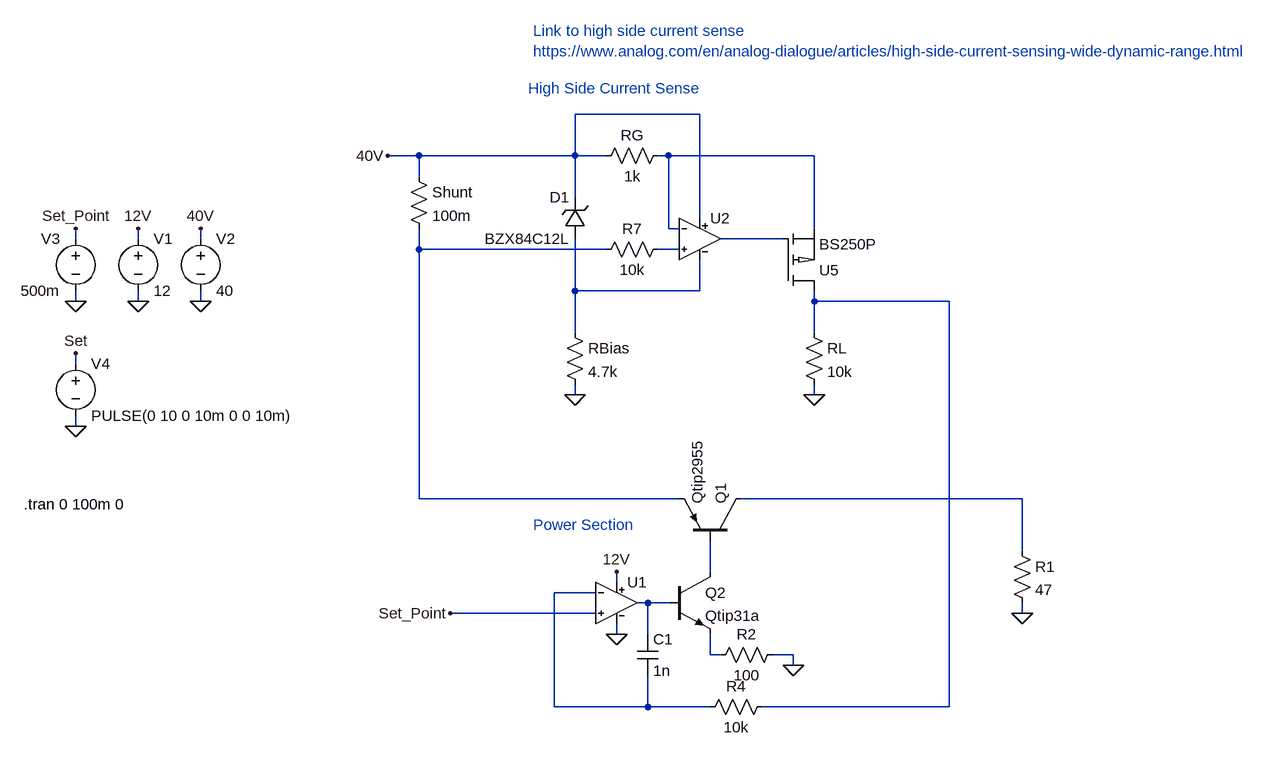
[diagram p0: schematic SolarEmulator.asc]
SolarEmulator.asc, the LTspice schematic file:
Version 4
SHEET 1 1780 980
WIRE 160 -64 -32 -64
WIRE -272 0 -320 0
WIRE -32 0 -32 -64
WIRE -32 0 -272 0
WIRE 16 0 -32 0
WIRE 112 0 96 0
WIRE 336 0 112 0
WIRE -272 32 -272 0
WIRE -32 64 -32 0
WIRE 160 96 160 -64
WIRE 112 112 112 0
WIRE 128 112 112 112
WIRE 336 112 336 0
WIRE -800 128 -800 112
WIRE -704 128 -704 112
WIRE -608 128 -608 112
WIRE 288 128 192 128
WIRE -272 144 -272 112
WIRE 16 144 -272 144
WIRE 128 144 96 144
WIRE -32 208 -32 128
WIRE 160 208 160 160
WIRE 160 208 -32 208
WIRE -800 224 -800 208
WIRE -704 224 -704 208
WIRE -608 224 -608 208
WIRE 336 224 336 208
WIRE 544 224 336 224
WIRE -32 272 -32 208
WIRE 336 272 336 224
WIRE -800 320 -800 304
WIRE -32 368 -32 352
WIRE 336 368 336 352
WIRE -800 416 -800 400
WIRE -272 528 -272 144
WIRE 128 528 -272 528
WIRE 656 528 224 528
WIRE 656 608 656 528
WIRE 176 640 176 592
WIRE 32 656 32 640
WIRE 0 672 -64 672
WIRE 80 688 64 688
WIRE 112 688 80 688
WIRE 0 704 -224 704
WIRE 656 704 656 688
WIRE 32 736 32 720
WIRE 80 736 80 688
WIRE 176 768 176 736
WIRE 192 768 176 768
WIRE 304 768 272 768
WIRE 304 784 304 768
WIRE -64 848 -64 672
WIRE 80 848 80 800
WIRE 80 848 -64 848
WIRE 176 848 80 848
WIRE 544 848 544 224
WIRE 544 848 256 848
FLAG -608 224 0
FLAG 336 368 0
FLAG -32 368 0
FLAG -608 112 40V
FLAG -320 0 40V
FLAG -704 224 0
FLAG -704 112 12V
FLAG 32 640 12V
FLAG 32 736 0
FLAG -800 224 0
FLAG -800 112 Set_Point
FLAG -224 704 Set_Point
FLAG -800 416 0
FLAG -800 304 Set
FLAG 304 784 0
FLAG 656 704 0
SYMBOL voltage -608 112 R0
WINDOW 123 0 0 Left 0
WINDOW 39 0 0 Left 0
SYMATTR InstName V2
SYMATTR Value 40
SYMBOL res 320 256 R0
SYMATTR InstName RL
SYMATTR Value 10k
SYMBOL res -48 256 R0
SYMATTR InstName RBias
SYMATTR Value 4.7k
SYMBOL res -288 16 R0
SYMATTR InstName Shunt
SYMATTR Value 100m
SYMBOL res 112 128 R90
WINDOW 0 0 56 VBottom 2
WINDOW 3 32 56 VTop 2
SYMATTR InstName R7
SYMATTR Value 10k
SYMBOL res 112 -16 R90
WINDOW 0 0 56 VBottom 2
WINDOW 3 32 56 VTop 2
SYMATTR InstName RG
SYMATTR Value 1k
SYMBOL zener -16 128 R180
WINDOW 0 24 64 Left 2
WINDOW 3 24 0 Left 2
SYMATTR InstName D1
SYMATTR Value BZX84C12L
SYMBOL pnp 224 592 M270
SYMATTR InstName Q1
SYMATTR Value Qtip2955
SYMBOL npn 112 640 R0
SYMATTR InstName Q2
SYMATTR Value Qtip31a
SYMBOL voltage -704 112 R0
WINDOW 123 0 0 Left 0
WINDOW 39 0 0 Left 0
SYMATTR InstName V1
SYMATTR Value 12
SYMBOL voltage -800 112 M0
WINDOW 123 0 0 Left 0
WINDOW 39 0 0 Left 0
SYMATTR InstName V3
SYMATTR Value 500m
SYMBOL res 272 832 R90
WINDOW 0 0 56 VBottom 2
WINDOW 3 32 56 VTop 2
SYMATTR InstName R4
SYMATTR Value 10k
SYMBOL voltage -800 304 R0
WINDOW 123 0 0 Left 0
WINDOW 39 0 0 Left 0
SYMATTR InstName V4
SYMATTR Value PULSE(0 10 0 10m 0 0 10m)
SYMBOL AutoGenerated\\BS250P 288 208 M180
SYMATTR InstName U5
SYMBOL AutoGenerated\\amp_tlv27x_highVdd 32 688 R0
SYMATTR InstName U1
SYMBOL AutoGenerated\\TL072 160 128 R0
SYMATTR InstName U2
SYMBOL cap 64 736 R0
SYMATTR InstName C1
SYMATTR Value 1n
SYMBOL res 288 752 R90
WINDOW 0 0 56 VBottom 2
WINDOW 3 32 56 VTop 2
SYMATTR InstName R2
SYMATTR Value 100
SYMBOL res 640 592 R0
SYMATTR InstName R1
SYMATTR Value 47
TEXT -880 536 Left 2 !.tran 0 100m 0
TEXT -104 -104 Left 2 ;High Side Current Sense
TEXT -96 568 Left 2 ;Power Section
TEXT -96 -192 Left 2 ;Link to high side current sense\nhttps://www.analog.com/en/analog-dialogue/articles/high-side-current-sensing-wide-dynamic-range.html

The netlist it stands for:
* SolarEmulator.asc
V2 40V 0 40
RL N006 0 10k
RBias N005 0 4.7k
R§Shunt 40V N003 100m
R7 N004 N003 10k
RG N001 40V 1k
D1 N005 40V BZX84C12L
Q1 N007 N008 N003 0 Qtip2955
Q2 N008 N010 N011 0 Qtip31a
V1 12V 0 12
V3 Set_Point 0 500m
R4 N006 N009 10k
V4 Set 0 PULSE(0 10 0 10m 0 0 10m)
XU5 N006 N002 N001 BS250P  ; pins D G S
XU1 Set_Point N009 12V 0 N010 amp_tlv27x_highVdd  ; pins In+ In- V+ V- OUT
XU2 N004 N001 40V N005 N002 TL072  ; pins In+ In- V+ V- OUT
C1 N010 N009 1n
R2 0 N011 100
R1 N007 0 47
.model D D
.lib standard.dio
.model NPN NPN
.model PNP PNP
.lib standard.bjt
.tran 0 100m 0
* High Side Current Sense
* Power Section
* Link to high side current sense
* https://www.analog.com/en/analog-dialogue/articles/high-side-current-sensing-wide-dynamic-range.html
.lib "BS250P.lib"
.lib "TLV271.LIB"
.lib "TL072.lib"
.backanno
.end